# Altium schematic sheet SoM-LowSpeed.SchDoc
size A3; DocumentNumber: 4; SheetNumber: 4; SheetTotal: 9; PageSetup: Record=PageOptions|CenterHorizontal=True|CenterVertical=True|PrintScale=0.97|XCorrection=1.00|YCorrection=1.00|PrintKind=1|BorderSize=5000000|LeftOffset=0|BottomOffset=0|Orientation=2|PaperLength=2970|PaperWidth=2100|Scale=100|PaperSource=7|PrintQuality=600|MediaType=1|DitherType=10|PaperKind=A4|PrintScaleMode=1
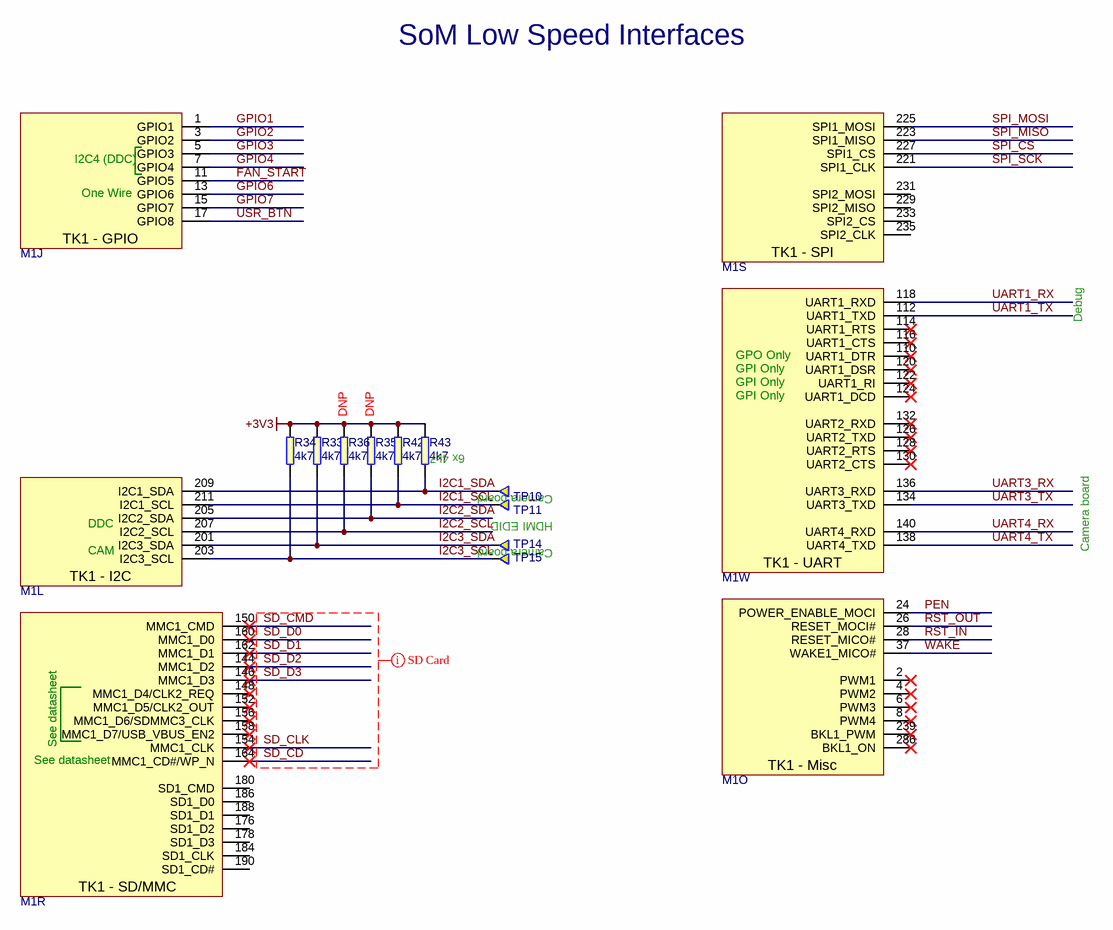
[diagram p0: SoM-LowSpeed.SchDoc]

## Parts
M1  MM70-314-310B1  [Apalis-H]  (value not drawn)  (parts J,L,O,R,S,W of 25)
R33  4k7  [0402]
R34  4k7  [0402]
R35  4k7  [0402]
R36  4k7  [0402]
R42  4k7  [0402]
R43  4k7  [0402]
TP10  TP-R-1.5  [TP-R-1.5]  (value not drawn)  (no BOM)
TP11  TP-R-1.5  [TP-R-1.5]  (value not drawn)  (no BOM)
TP14  TP-R-1.5  [TP-R-1.5]  (value not drawn)  (no BOM)
TP15  TP-R-1.5  [TP-R-1.5]  (value not drawn)  (no BOM)

## Nets
+3V3: R33.2 R34.2 R35.2 R36.2 R42.2 R43.2
FAN_START: M1.11(GPIO5)
GPIO1: M1.1(GPIO1)
GPIO2: M1.3(GPIO2)
GPIO3: M1.5(GPIO3)
GPIO4: M1.7(GPIO4)
GPIO6: M1.13(GPIO6)
GPIO7: M1.15(GPIO7)
I2C1_SCL: M1.211(I2C1_SCL) R42.1 TP11.1
I2C1_SDA: M1.209(I2C1_SDA) R43.1 TP10.1
I2C2_SCL: M1.207(I2C2_SCL) R36.1
I2C2_SDA: M1.205(I2C2_SDA) R35.1
I2C3_SCL: M1.203(I2C3_SCL) R34.1 TP15.1
I2C3_SDA: M1.201(I2C3_SDA) R33.1 TP14.1
PEN: M1.24(POWER_ENABLE_MOCI)
RST_IN: M1.28(RESET_MICO#)
RST_OUT: M1.26(RESET_MOCI#)
SD_CD: M1.164(MMC1_CD#/WP_N)
SD_CLK: M1.154(MMC1_CLK)
SD_CMD: M1.150(MMC1_CMD)
SD_D0: M1.160(MMC1_D0)
SD_D1: M1.162(MMC1_D1)
SD_D2: M1.144(MMC1_D2)
SD_D3: M1.146(MMC1_D3)
SPI_CS: M1.227(SPI1_CS)
SPI_MISO: M1.223(SPI1_MISO)
SPI_MOSI: M1.225(SPI1_MOSI)
SPI_SCK: M1.221(SPI1_CLK)
UART1_RX: M1.118(UART1_RXD)
UART1_TX: M1.112(UART1_TXD)
UART3_RX: M1.136(UART3_RXD)
UART3_TX: M1.134(UART3_TXD)
UART4_RX: M1.140(UART4_RXD)
UART4_TX: M1.138(UART4_TXD)
USR_BTN: M1.17(GPIO8)
WAKE: M1.37(WAKE1_MICO#)

Not connected (* = marked no-connect by the designer): M1 2(PWM1)* 4(PWM2)* 6(PWM3)* 8(PWM4)* 110(UART1_DTR)* 114(UART1_RTS)* 116(UART1_CTS)* 120(UART1_DSR)* 122(UART1_RI)* 124(UART1_DCD)* 126(UART2_TXD)* 128(UART2_RTS)* 130(UART2_CTS)* 132(UART2_RXD)* 148(MMC1_D4/CLK2_REQ)* 152(MMC1_D5/CLK2_OUT)* 156(MMC1_D6/SDMMC3_CLK)* 158(MMC1_D7/USB_VBUS_EN2)* 176(SD1_D2) 178(SD1_D3) 180(SD1_CMD) 184(SD1_CLK) 186(SD1_D0) 188(SD1_D1) 190(SD1_CD#) 229(SPI2_MISO) 231(SPI2_MOSI) 233(SPI2_CS) 235(SPI2_CLK) 239(BKL1_PWM)* 286(BKL1_ON)*

## Layout directives
net class SD: SD_CD, SD_CLK, SD_CMD, SD_D0, SD_D1, SD_D2, SD_D3

## Notes on the sheet
- SoM Low Speed Interfaces
- Debug
- DNP
- 6x 4k7
- Camera board
- HDMI EDID
- Title:
- Size:
- Date:
- A3
- Revision:
- Page:
- of
- Antmicro Ltd.
- File:
- www.antmicro.com
- (in symbol Apalis-TK1-H, part J) I2C4 (DDC); One Wire; TK1 - GPIO
- (in symbol Apalis-TK1-H, part L) DDC; CAM; TK1 - I2C
- (in symbol Apalis-TK1-H, part O) TK1 - Misc
- (in symbol Apalis-TK1-H, part R) See datasheet; TK1 - SD/MMC
- (in symbol Apalis-TK1-H, part S) TK1 - SPI
- (in symbol Apalis-TK1-H, part W) GPO Only; GPI Only; TK1 - UART

## Library data of the parts
M1 = Apalis-TK1-H: Toradex Apalis TK1, Horizontal; Manufacturer: JAE Electronics; Part Number: Apalis-TK1-H; Part Symbol: MM70-314-310B1; Value: MM70-314-310B1; MPN: MM70-314-310B1
R33-R36 R42 R43 = R_4k7_0402: RES, 4k7, 0402; Manufacturer: Panasonic; Part Symbol: ERJ2GEJ472X; Value: 4k7; Part Number: R_4k7_0402; MPN: ERJ2GEJ472X
TP10 TP11 TP14 TP15 = TP-R-1.5: Testpad, round, 1.5mm; Part Number: TP-R-1.5